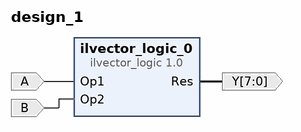
[diagram p0: block diagram of the top level]
# Vivado block design design_1, xc7a35tftg256-1, Vivado 2024.2
create_bd_design design_1

create_bd_port -dir I A
create_bd_port -dir I B
create_bd_port -dir O -from 7 -to 0 Y

create_bd_cell -type inline_hdl -vlnv xilinx.com:inline_hdl:ilvector_logic:1.0 ilvector_logic_0
set_property -dict {CONFIG.C_OPERATION and} [get_bd_cells ilvector_logic_0]

# ---- connections ----

connect_bd_net [get_bd_ports A] [get_bd_pins ilvector_logic_0/Op1]
connect_bd_net [get_bd_ports B] [get_bd_pins ilvector_logic_0/Op2]
connect_bd_net [get_bd_pins ilvector_logic_0/Res] [get_bd_ports Y]

validate_bd_design
save_bd_design
